# EAGLE schematic circuito_mosfet (EAGLE 9.5.1)
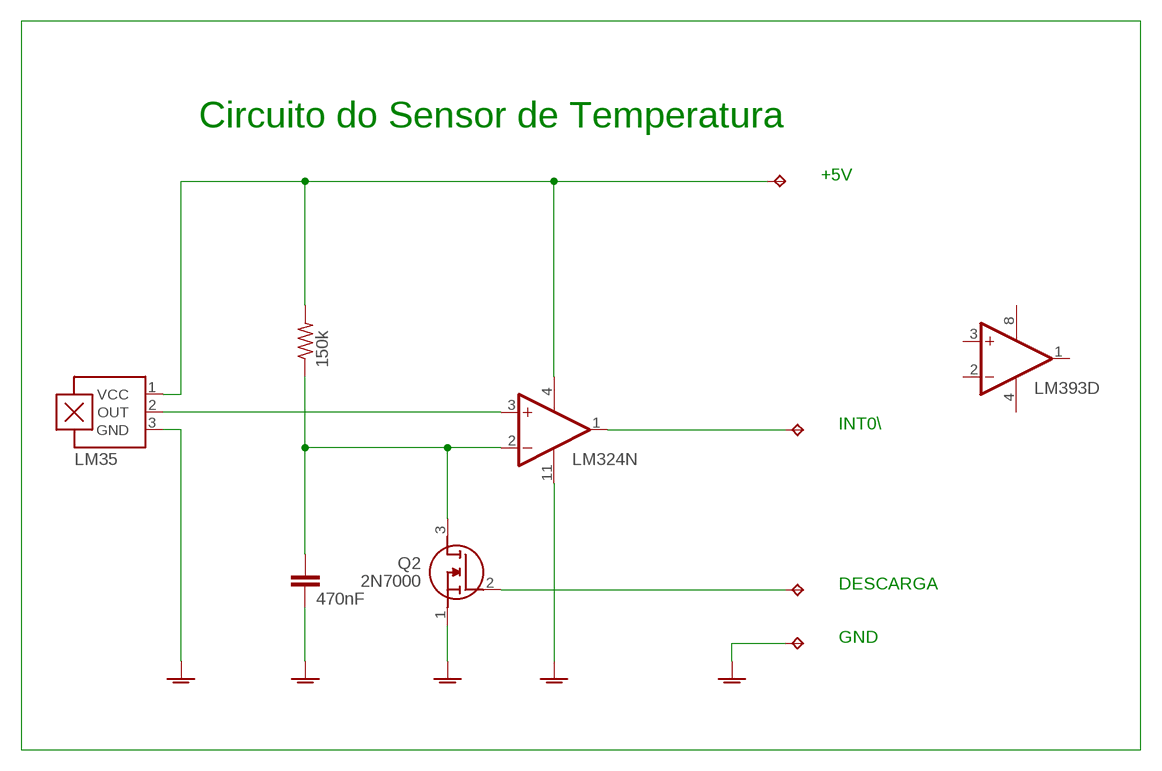
[diagram p0: schematic, sheet 1]

## Parts
C1  470nF  C2,5-3  [C2.5-3]
IC1  LM324N  [DIL14]
IC2  LM393D  [SO08]
IC3  LM35  A1301LH  [SOT23-W]
Q2  2N7000  [TO-92_(TO-226)]
R1  150k  R-US_0207/10  [0207/10]
TP1  TPB1,27  [B1,27]
TP2  TPB1,27  [B1,27]
TP3  TPB1,27  [B1,27]
TP4  TPB1,27  [B1,27]

## Nets
GNDA: C1.2 IC1.11(P:V-) IC3.3(GND) Q2.1(S) TP2.TP
N$2: C1.1 IC1.2(A:-IN) Q2.3(D) R1.1
N$3: IC1.3(A:+IN) IC3.2(OUT)
N$4: Q2.2(G) TP3.TP
N$6: IC1.1(A:OUT) TP4.TP
N$7: IC1.4(P:V+) IC3.1(VCC) R1.2 TP1.TP
Unconnected: IC1.5(B:+IN) IC1.6(B:-IN) IC1.7(B:OUT) IC1.8(C:OUT) IC1.9(C:-IN) IC1.10(C:+IN) IC1.12(D:+IN) IC1.13(D:-IN) IC1.14(D:OUT) IC2.1(A:OUT) IC2.2(A:-IN) IC2.3(A:+IN) IC2.5(B:+IN) IC2.6(B:-IN) IC2.7(B:OUT)

## Notes on the sheet
- Circuito do Sensor de Temperatura
- +5V
- INT0\
- DESCARGA
- GND

## Power pins joined to a net without a drawn wire
V+: IC2.8(P:V+)
V-: IC2.4(P:V-)

## Library data of the parts
C1 = capacitor-wima:C: CAPACITOR naming: grid - package width
IC1 = linear:LM324: OP AMP
IC2 = linear:LM393: COMPARATOR
IC3 = allegro:A13*?: Linear Hall Effect Sensor ICs Continuous-Time Ratiometric High-Temperature Operation Programmable Linear with Analog Output A1302 -Replacement- UGN3503 Source: http://www.allegromicro.com/en/Products/Part_Numbers/1301/1301.pdf http://www.allegromicro.com/en/Products/Part_Numbers/1321/1321.pdf http://www.allegromicro.com/en/Products/Part_Numbers/1381/1381.pdf; MF: ALLEGRO MICROSYSTEMS, INC.; MPN: A1301ELHLT-T; OC_FARNELL: 1198084; OC_NEWARK: 31K6634
Q2 = 2N7000:2N7000: N-channel MOSFET,2N7000 0.2A 60V Source: Datasheet <http://www.onsemi.com/pub/Collateral/NDS7002A-D.PDF>; DESCRIPTION: N-channel MOSFET,2N7000 0.2A 60V; HEIGHT: 5.33mm; MANUFACTURER_NAME: onsemi; MANUFACTURER_PART_NUMBER: 2N7000; MOUSER_PART_NUMBER: 512-2N7000; MOUSER_PRICE-STOCK: https://www.mouser.co.uk/ProductDetail/onsemi-Fairchild/2N7000?qs=FOlmdCx%252BAA2o%2FKZOTk%2F3hg%3D%3D
R1 = rcl:R-US_: RESISTOR, American symbol; SPICEPREFIX: R
TP1-TP4 = testpad:TP: Test pad